# Altium schematic sheet power.SchDoc
size A4; SheetNumber: 3; SheetTotal: 3
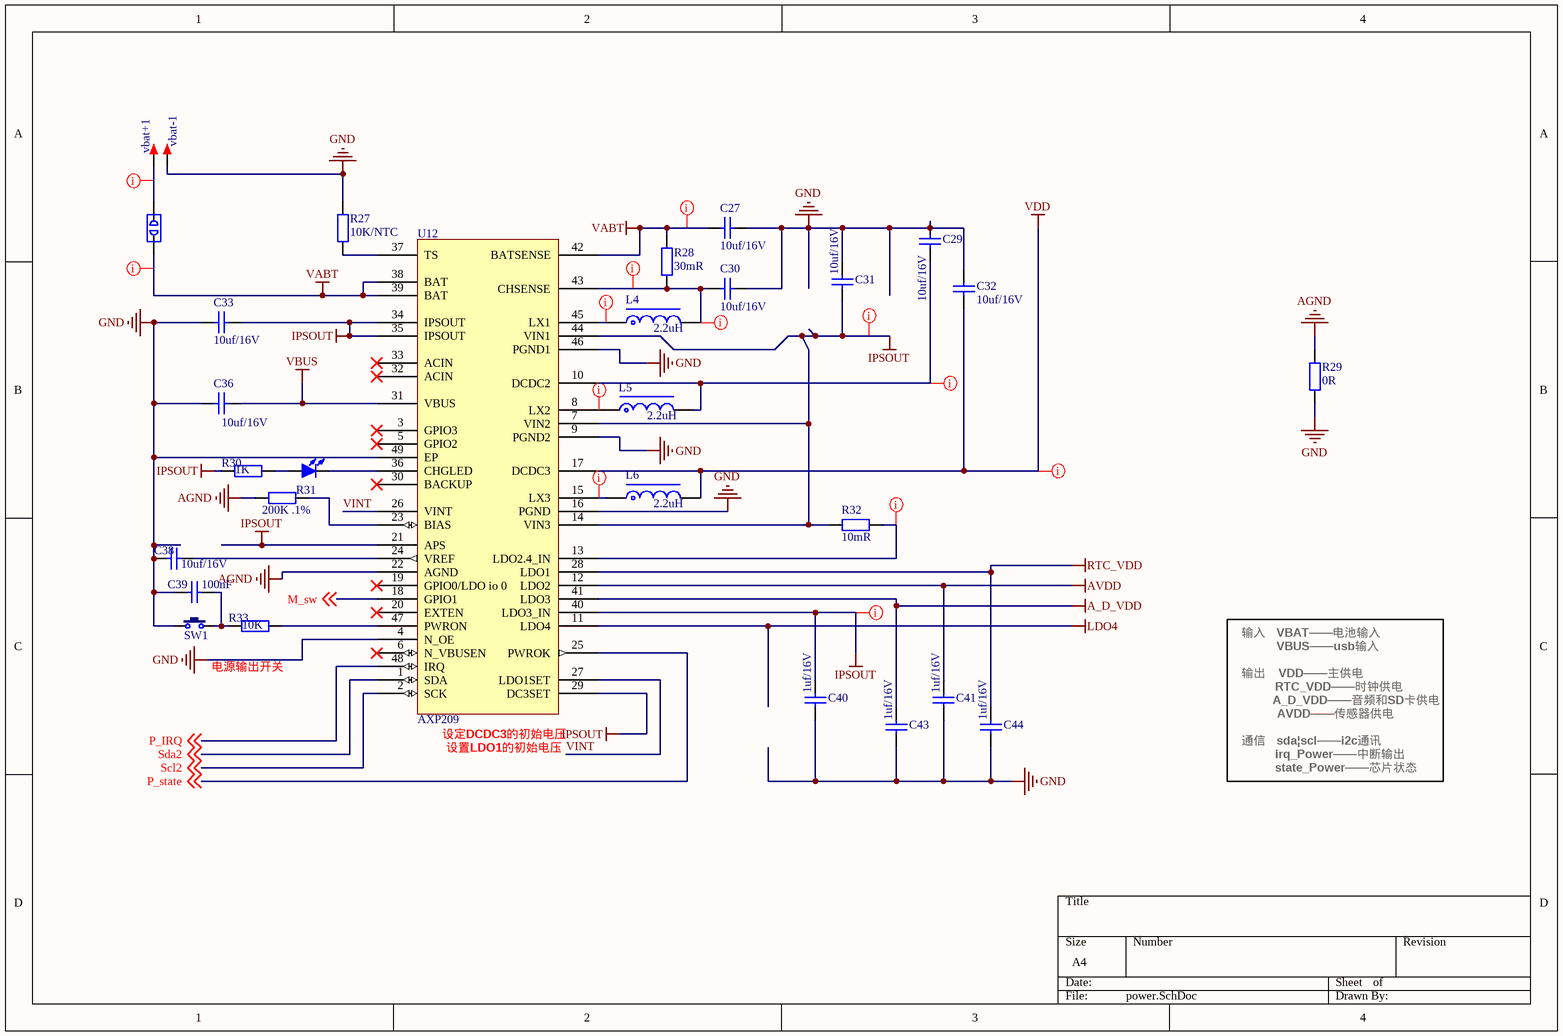
[diagram p0: power.SchDoc]

## Parts
C27  10uf/16V  [C 0603_L]
C29  10uf/16V  [C 0603_L]
C30  10uf/16V  [C 0603_L]
C31  10uf/16V  [C 0603_L]
C32  10uf/16V  [C 0603_L]
C33  10uf/16V  [C 0603_L]
C36  10uf/16V  [C 0603_L]
C38  10uf/16V  [C 0603_L]
C39  100nF  [C 0603_L]
C40  1uf/16V  [C 0603_L]
C41  1uf/16V  [C 0603_L]
C43  1uf/16V  [C 0603_L]
C44  1uf/16V  [C 0603_L]
DE2  DEBUG PAD  [DEBUG_B]  (value not drawn)
L4  2.2uH  [NR2520]
L5  2.2uH  [NR2520]
L6  2.2uH  [NR2520]
LED1  红色  [LED 0603W]  (value not drawn)
R27  10K/NTC  [R 0603_L]
R28  30mR  [R 0805_L]
R29  0R  [R 0603_L]
R30  1K  [R 0603_L]
R31  200K .1%  [R 0603_L]
R32  10mR  [R 0805_L]
R33  10K  [R 0603_L]
SW1  3x6x5  [TSW 3*6*4.3-S-W]  (value not drawn)
U12  AXP209  [QFN-48_L6.0-W6.0-P0.40-TL-EP4.2]
vbat+1  TEST  [TEST 1.6]  (value not drawn)
vbat-1  TEST  [TEST 1.6]  (value not drawn)

## Nets
A_D_VDD: C43.1 U12.41(LDO3)
AGND: R29.2 R31.1 U12.22(AGND)
AVDD: C41.1 U12.12(LDO2)
GND: C27.1 C29.1 C30.1 C31.1 C32.1 C33.2 C36.1 C38.1 C39.1 C40.2 C41.2 C43.2 C44.2 R27.1 R29.1 SW1.1 U12.4(N_OE) U12.9(PGND2) U12.16(PGND) U12.46(PGND1) U12.49(EP) vbat-1.1
IPSOUT: C31.2 C33.1 C40.1 R30.1 R32.1 U12.7(VIN2) U12.14(VIN3) U12.21(APS) U12.29(DC3SET) U12.34(IPSOUT) U12.35(IPSOUT) U12.40(LDO3_IN) U12.44(VIN1)
LDO4: U12.11(LDO4)
RTC_VDD: C44.1 U12.28(LDO1)
VABT: C27.2 DE2.2 R28.2 U12.38(BAT) U12.39(BAT) U12.42(BATSENSE)
VBUS: C36.2 U12.31(VBUS)
VDD: C32.2 L6.2 U12.17(DCDC3)
M_sw: U12.18(GPIO1) ; off-sheet M_sw
P_IRQ: U12.48(IRQ) ; off-sheet P_IRQ
P_state: U12.25(PWROK) ; off-sheet P_state
Scl2: U12.2(SCK) ; off-sheet Scl2
Sda2: U12.1(SDA) ; off-sheet Sda2
VINT: U12.26(VINT) U12.27(LDO1SET)
NetC29_2: C29.2 L5.2 U12.10(DCDC2)
NetC30_2: C30.2 L4.2 R28.1 U12.43(CHSENSE)
NetC38_2: C38.2 U12.24(VREF)
NetC39_2: C39.2 R33.1 SW1.2
NetDE2_1: DE2.1 vbat+1.1
NetL4_1: L4.1 U12.45(LX1)
NetL5_1: L5.1 U12.8(LX2)
NetL6_1: L6.1 U12.15(LX3)
NetLED1_1: LED1.1(A) R30.2
NetLED1_2: LED1.2(K) U12.36(CHGLED)
NetR27_2: R27.2 U12.37(TS)
NetR31_2: R31.2 U12.23(BIAS)
NetR32_2: R32.2 U12.13(LDO2.4_IN)
NetR33_2: R33.2 U12.47(PWRON)

Not connected (* = marked no-connect by the designer): U12 3(GPIO3)* 5(GPIO2)* 6(N_VBUSEN)* 19(GPIO0/LDO_io_0)* 20(EXTEN)* 30(BACKUP)* 32(ACIN)* 33(ACIN)*

## Layout directives
net class Power: IPSOUT, NetC29_2, NetC30_2, NetDE2_1, NetL4_1, NetL5_1, NetL6_1, NetR32_2, VABT, VDD

## Notes on the sheet
- 输入
- VBUS——usb输入
- VBAT——电池输入
- 电源输出开关
- 输出
- VDD——主供电
- AVDD——传感器供电
- RTC_VDD——时钟供电
- A_D_VDD——音频和SD卡供电
- (near U12) 设定DCDC3的初始电压
- (near U12) 设置LDO1的初始电压
- 通信
- sda|scl——i2c通讯
- irq_Power——中断输出
- state_Power——芯片状态

## Library data of the parts
C27 C29-C33 C36 C38-C41 C43 C44 = C: 贴片电容; BOM名称: 无极性贴片电容; 联系卖家，免费查找封装: 唯一出售店铺网址https://shop463601444.taobao.com; 封装库来自淘宝卖家ID：黄晶宝石: 其他店铺购入均为盗版假冒封装库
DE2 = DEBUG: 调试断点焊盘; 联系卖家，免费查找封装: 唯一出售店铺网址https://shop463601444.taobao.com; BOM名称: 调试断点焊盘
L4-L6 = L-NR: NR磁胶电感; 联系卖家，免费查找封装: 唯一出售店铺网址https://shop463601444.taobao.com; 封装库来自淘宝卖家ID：黄晶宝石: 其他店铺购入均为盗版假冒封装库; BOM名称: NR磁胶电感
LED1 = LED-SMD: 贴片LED; 封装库来自淘宝卖家 ID：黄晶宝石: 其他店铺购入均为假冒，请立即申请退款，本店奖励2~5元现金; BOM名称: 贴片LED
R27-R33 = R: 贴片电阻; 联系卖家，免费查找封装: 唯一出售店铺网址https://shop463601444.taobao.com; 封装库来自淘宝卖家ID：黄晶宝石: 其他店铺购入均为盗版假冒封装库; BOM名称: 贴片电阻
SW1 = TSW 3x6: 3x6轻触开关; 联系卖家，免费查找封装: 唯一出售店铺网址https://shop463601444.taobao.com; BOM名称: 3x6轻触开关
U12 = AXP209: 高度集 成的电源系统管 理芯片 ， 针对单芯 锂电池( 锂离子或 锂聚合物) 且需要多 路电源转换 / 输出 的应用 ，提供简 单易用 而又可以 灵活配 置的完整 电源解 决方案， 充分满 足目前日 益复杂 的应用处 理 / 器系统对 于电源精确控制 的要求
vbat+1 vbat-1 = TEST: 测试点; 联系卖家，免费查找封装: 唯一出售店铺网址https://shop463601444.taobao.com; BOM名称: 测试点